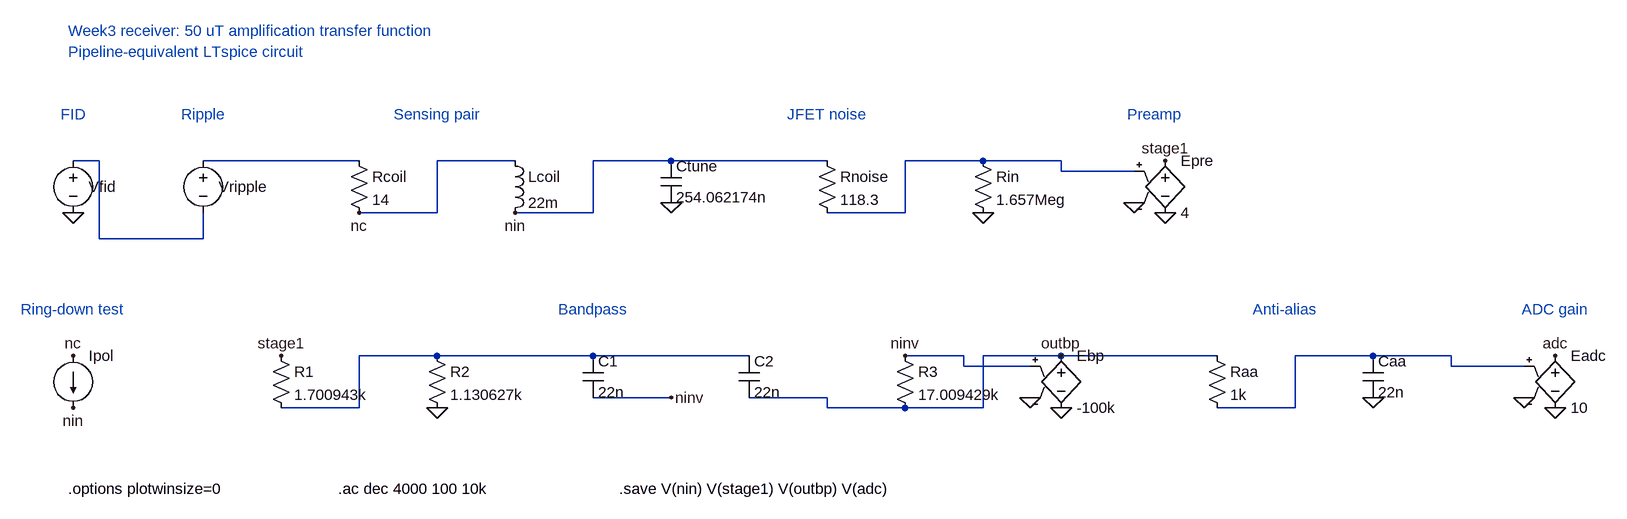
[diagram p0: schematic week3-working-receiver-50ut-transfer.asc]
week3-working-receiver-50ut-transfer.asc, the LTspice schematic file:
Version 4
SHEET 1 2500 840
FLAG 80 320 0
FLAG 520 320 nc
FLAG 760 320 nin
FLAG 1000 304 0
FLAG 1480 320 0
FLAG 1760 240 stage1
FLAG 1760 320 0
FLAG 1712 304 0
FLAG 400 540 stage1
FLAG 640 620 0
FLAG 1600 540 outbp
FLAG 1600 620 0
FLAG 1552 604 0
FLAG 2080 604 0
FLAG 2360 540 adc
FLAG 2360 620 0
FLAG 2312 604 0
FLAG 80 540 nc
FLAG 80 620 nin
FLAG 1000 604 ninv
FLAG 1360 540 ninv
WIRE 80 240 120 240
WIRE 120 240 120 360
WIRE 120 360 280 360
WIRE 280 320 280 360
WIRE 280 240 520 240
WIRE 520 320 640 320
WIRE 640 240 640 320
WIRE 640 240 760 240
WIRE 760 320 880 320
WIRE 880 240 880 320
WIRE 880 240 1240 240
WIRE 1240 320 1360 320
WIRE 1360 240 1360 320
WIRE 1360 240 1480 240
WIRE 1480 240 1600 240
WIRE 1600 240 1600 256
WIRE 1600 256 1712 256
WIRE 400 620 520 620
WIRE 520 540 520 620
WIRE 520 540 1120 540
WIRE 880 604 1000 604
WIRE 1360 540 1450 540
WIRE 1450 540 1450 556
WIRE 1450 556 1552 556
WIRE 1120 604 1240 604
WIRE 1240 604 1240 620
WIRE 1240 620 1360 620
WIRE 1360 620 1480 620
WIRE 1480 540 1480 620
WIRE 1480 540 1840 540
WIRE 1840 620 1960 620
WIRE 1960 540 1960 620
WIRE 1960 540 2080 540
WIRE 2080 540 2200 540
WIRE 2200 540 2200 556
WIRE 2200 556 2312 556
SYMBOL voltage 80 224 R0
WINDOW 0 24 56 Left 2
WINDOW 3 0 0 Invisible 2
SYMATTR InstName Vfid
SYMATTR Value SINE(0 1.008442u 2128.819237 200m 1.052632) AC 1
SYMBOL voltage 280 224 R0
WINDOW 0 24 56 Left 2
WINDOW 3 0 0 Invisible 2
SYMATTR InstName Vripple
SYMATTR Value SINE(0 0.5u 2k)
SYMBOL res 504 224 R0
SYMATTR InstName Rcoil
SYMATTR Value 14
SYMBOL ind 744 224 R0
SYMATTR InstName Lcoil
SYMATTR Value 22m
SYMBOL cap 984 240 R0
SYMATTR InstName Ctune
SYMATTR Value 254.062174n
SYMBOL res 1224 224 R0
SYMATTR InstName Rnoise
SYMATTR Value 118.3
SYMBOL res 1464 224 R0
SYMATTR InstName Rin
SYMATTR Value 1.657Meg
SYMBOL e 1760 224 R0
WINDOW 0 24 16 Left 2
WINDOW 3 24 96 Left 2
SYMATTR InstName Epre
SYMATTR Value 4
SYMBOL res 384 524 R0
SYMATTR InstName R1
SYMATTR Value 1.700943k
SYMBOL res 624 524 R0
SYMATTR InstName R2
SYMATTR Value 1.130627k
SYMBOL cap 864 540 R0
SYMATTR InstName C1
SYMATTR Value 22n
SYMBOL cap 1104 540 R0
SYMATTR InstName C2
SYMATTR Value 22n
SYMBOL res 1344 524 R0
SYMATTR InstName R3
SYMATTR Value 17.009429k
SYMBOL e 1600 524 R0
WINDOW 0 24 16 Left 2
WINDOW 3 24 96 Left 2
SYMATTR InstName Ebp
SYMATTR Value -100k
SYMBOL res 1824 524 R0
SYMATTR InstName Raa
SYMATTR Value 1k
SYMBOL cap 2064 540 R0
SYMATTR InstName Caa
SYMATTR Value 22n
SYMBOL e 2360 524 R0
WINDOW 0 24 16 Left 2
WINDOW 3 24 96 Left 2
SYMATTR InstName Eadc
SYMATTR Value 10
SYMBOL current 80 540 R0
WINDOW 3 0 0 Invisible 2
SYMATTR InstName Ipol
SYMATTR Value PWL(0 1m 0.4m 1m 0.5m 0 230m 0)
TEXT 72 40 Left 2 ;Week3 receiver: 50 uT amplification transfer function
TEXT 72 72 Left 2 ;Pipeline-equivalent LTspice circuit
TEXT 80 168 Center 2 ;FID
TEXT 280 168 Center 2 ;Ripple
TEXT 640 168 Center 2 ;Sensing pair
TEXT 1240 168 Center 2 ;JFET noise
TEXT 1744 168 Center 2 ;Preamp
TEXT 80 468 Center 2 ;Ring-down test
TEXT 880 468 Center 2 ;Bandpass
TEXT 1944 468 Center 2 ;Anti-alias
TEXT 2360 468 Center 2 ;ADC gain
TEXT 72 744 Left 2 !.options plotwinsize=0
TEXT 488 744 Left 2 !.ac dec 4000 100 10k
TEXT 920 744 Left 2 !.save V(nin) V(stage1) V(outbp) V(adc)

The netlist it stands for:
* week3-working-receiver-50ut-transfer.asc
Vfid N001 0 SINE(0 1.008442u 2128.819237 200m 1.052632) AC 1
Vripple N002 N001 SINE(0 0.5u 2k)
Rcoil N002 nc 14
Lcoil nc nin 22m
Ctune nin 0 254.062174n
Rnoise nin N003 118.3
Rin N003 0 1.657Meg
Epre stage1 0 N003 0 4
R1 stage1 N004 1.700943k
R2 N004 0 1.130627k
C1 N004 ninv 22n
C2 N004 outbp 22n
R3 ninv outbp 17.009429k
Ebp outbp 0 ninv 0 -100k
Raa outbp N005 1k
Caa N005 0 22n
Eadc adc 0 N005 0 10
Ipol nc nin PWL(0 1m 0.4m 1m 0.5m 0 230m 0)
* Week3 receiver: 50 uT amplification transfer function
* Pipeline-equivalent LTspice circuit
* FID
* Ripple
* Sensing pair
* JFET noise
* Preamp
* Ring-down test
* Bandpass
* Anti-alias
* ADC gain
.options plotwinsize=0
.ac dec 4000 100 10k
.save V(nin) V(stage1) V(outbp) V(adc)
.backanno
.end